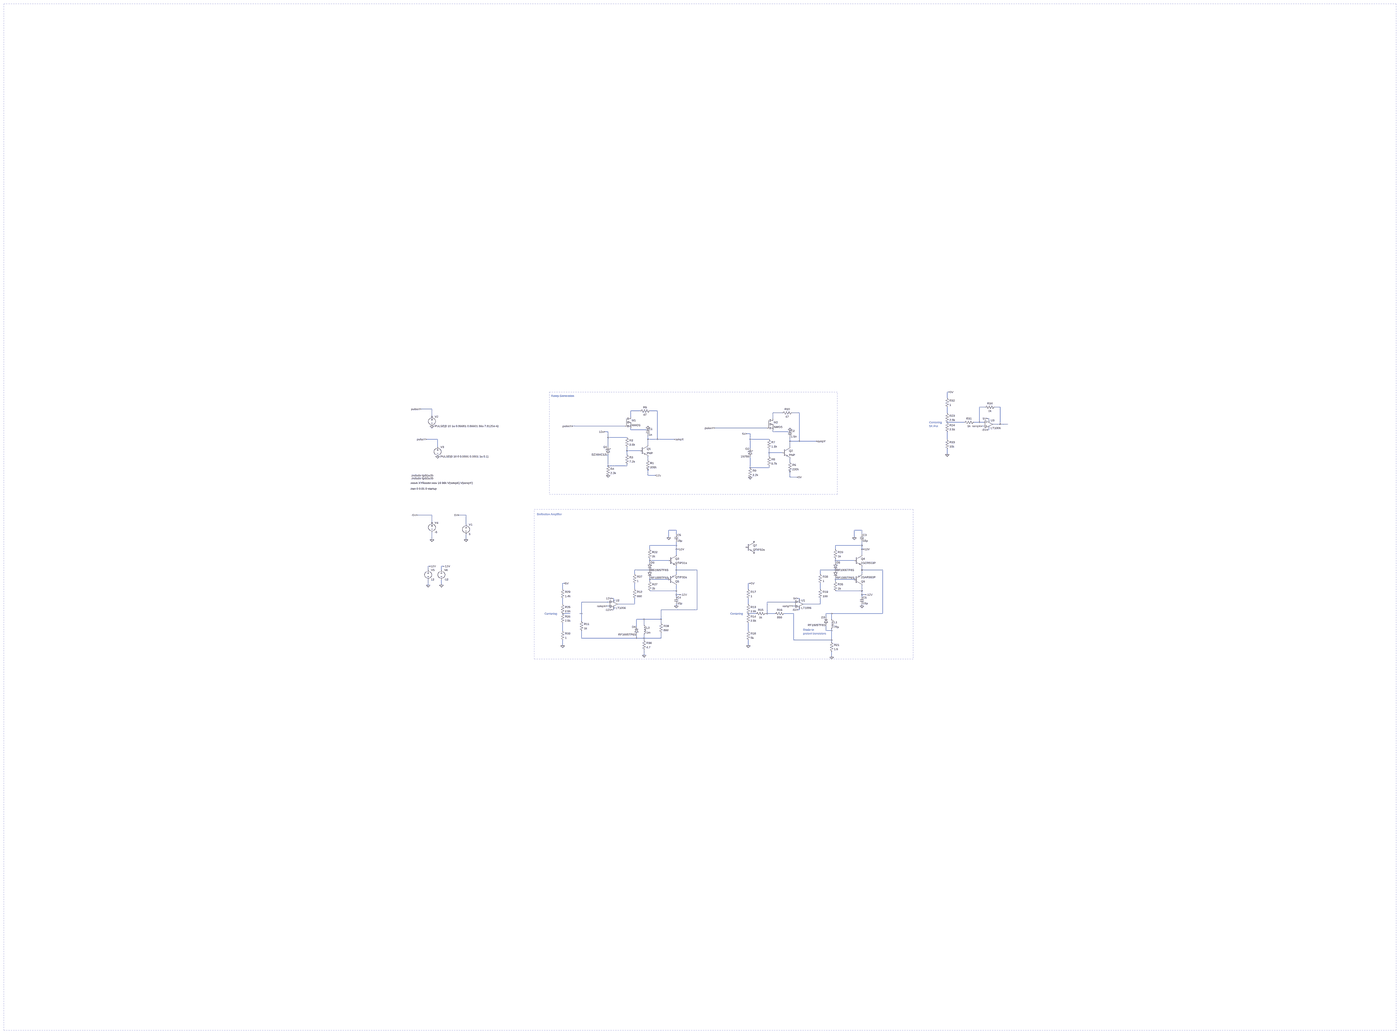
[diagram p0: schematic XYRasterScanGen.asc, whole sheet]
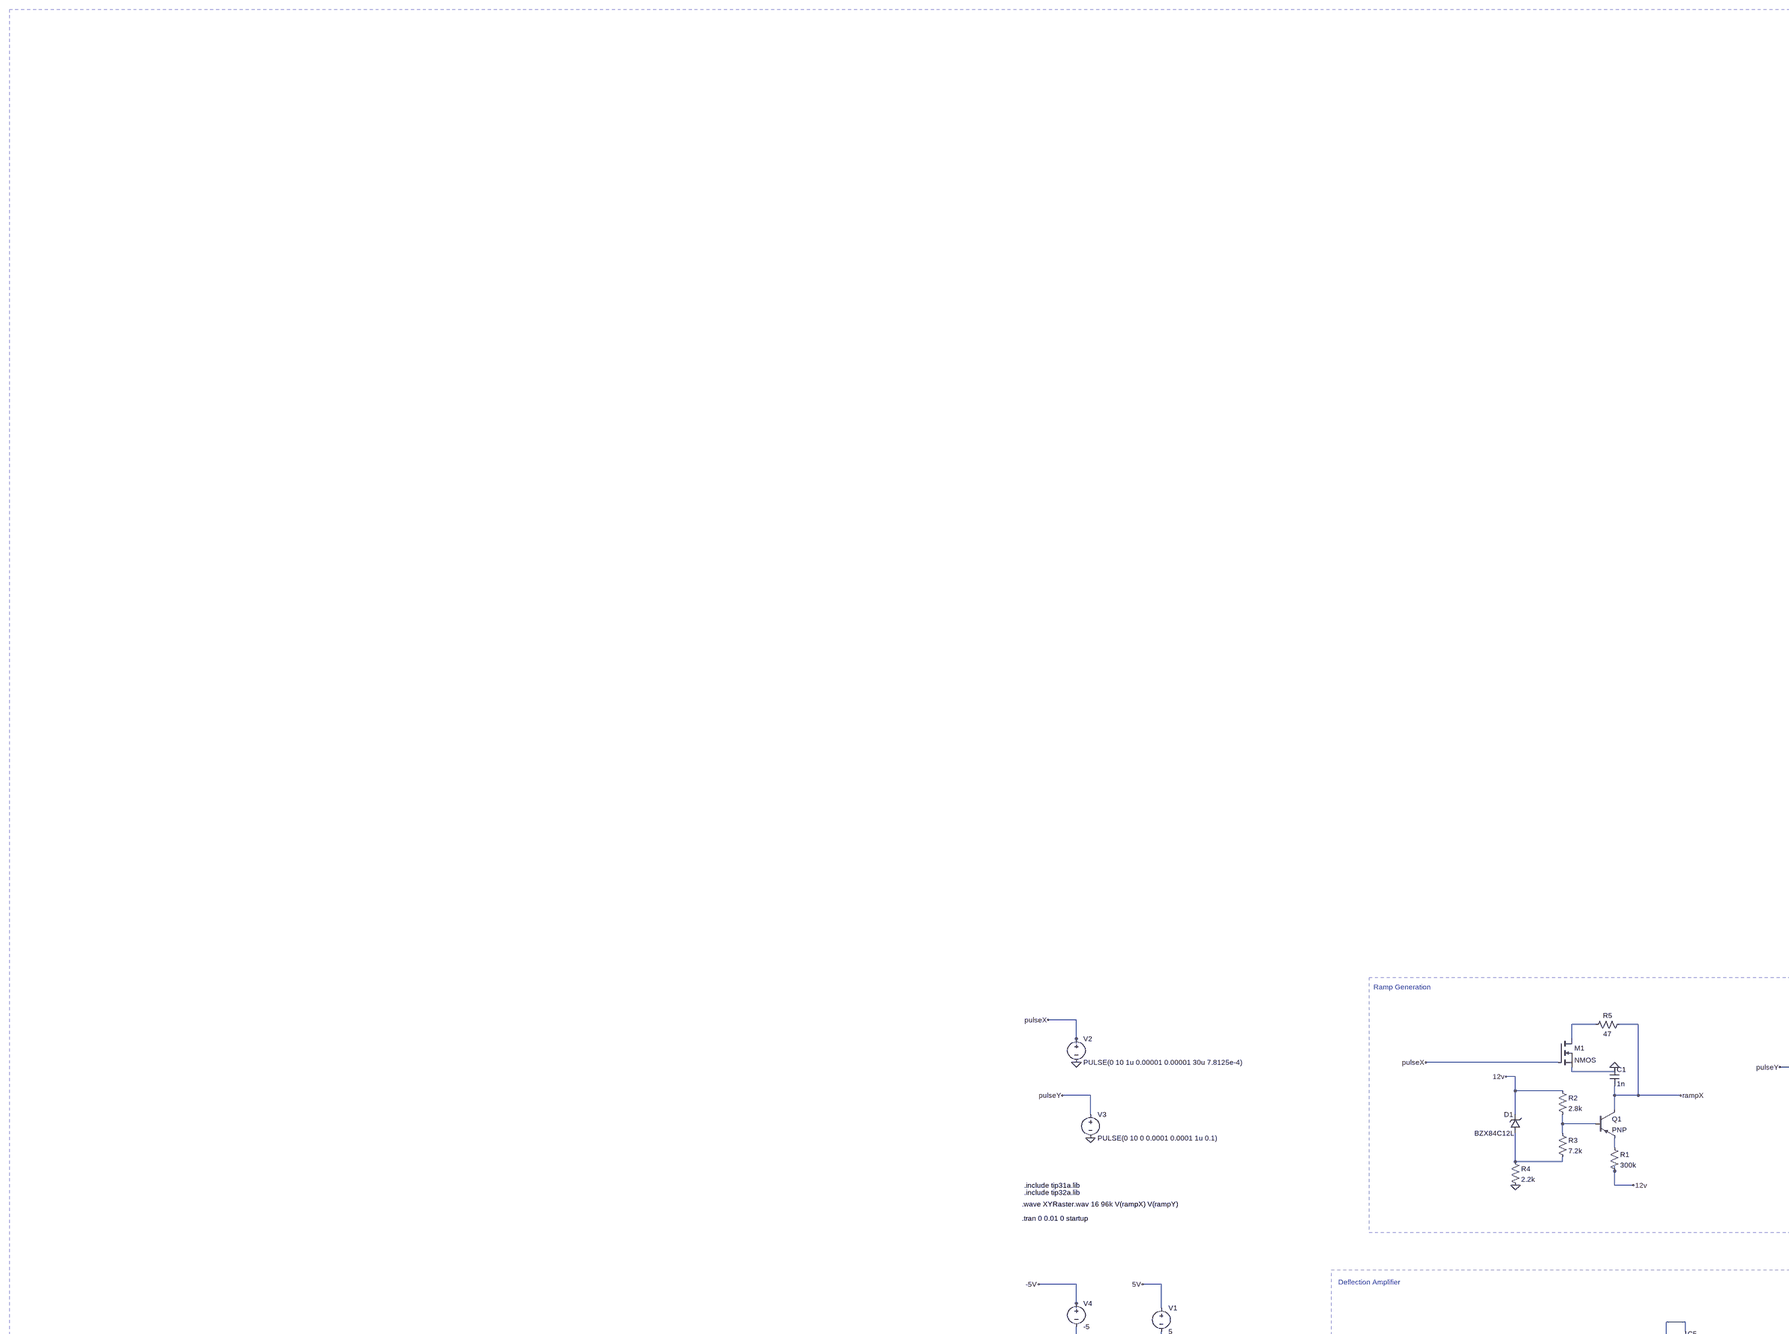
[diagram p1: schematic XYRasterScanGen.asc, part, row 1 of 2, column 1 of 2]
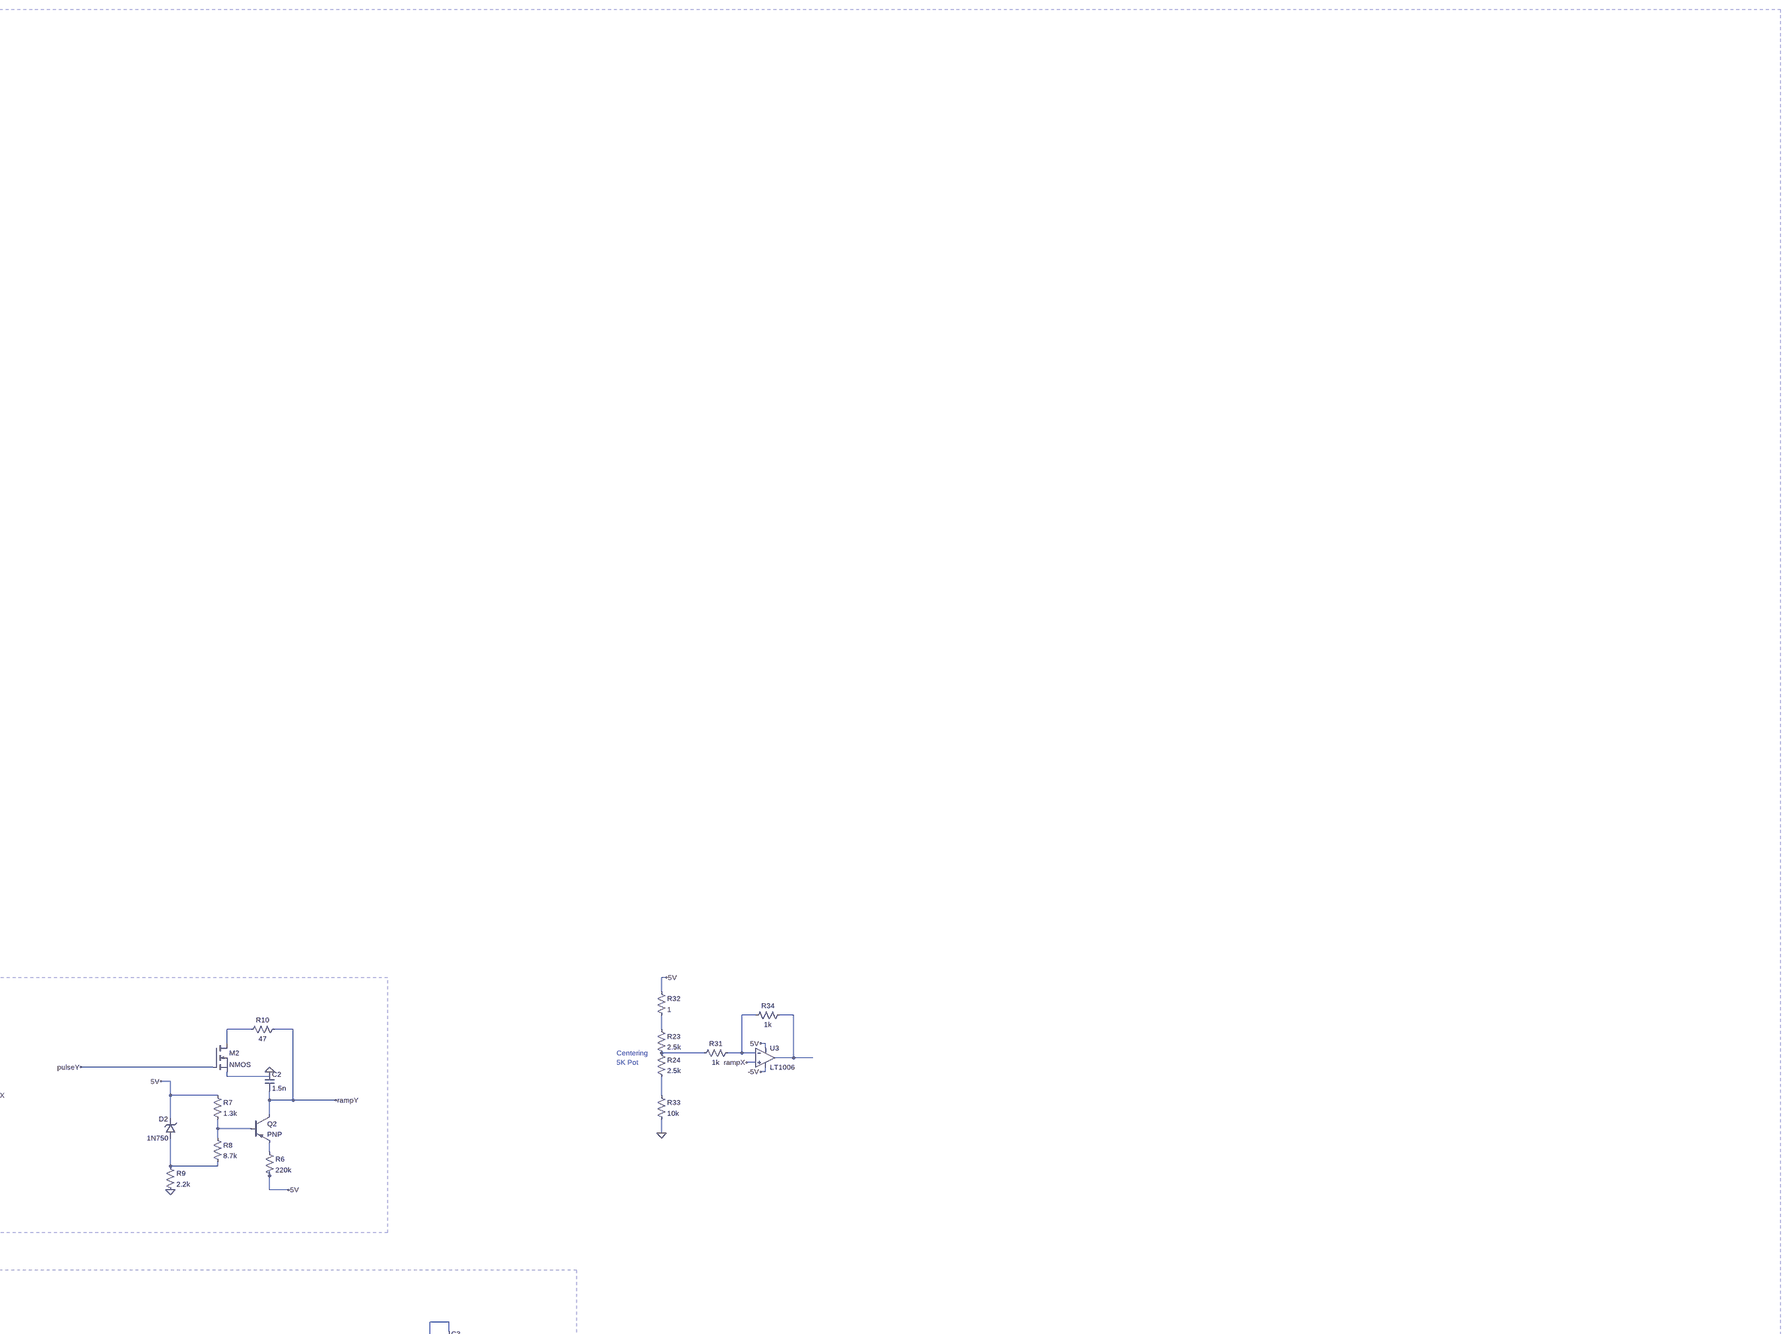
[diagram p2: schematic XYRasterScanGen.asc, part, row 1 of 2, column 2 of 2]
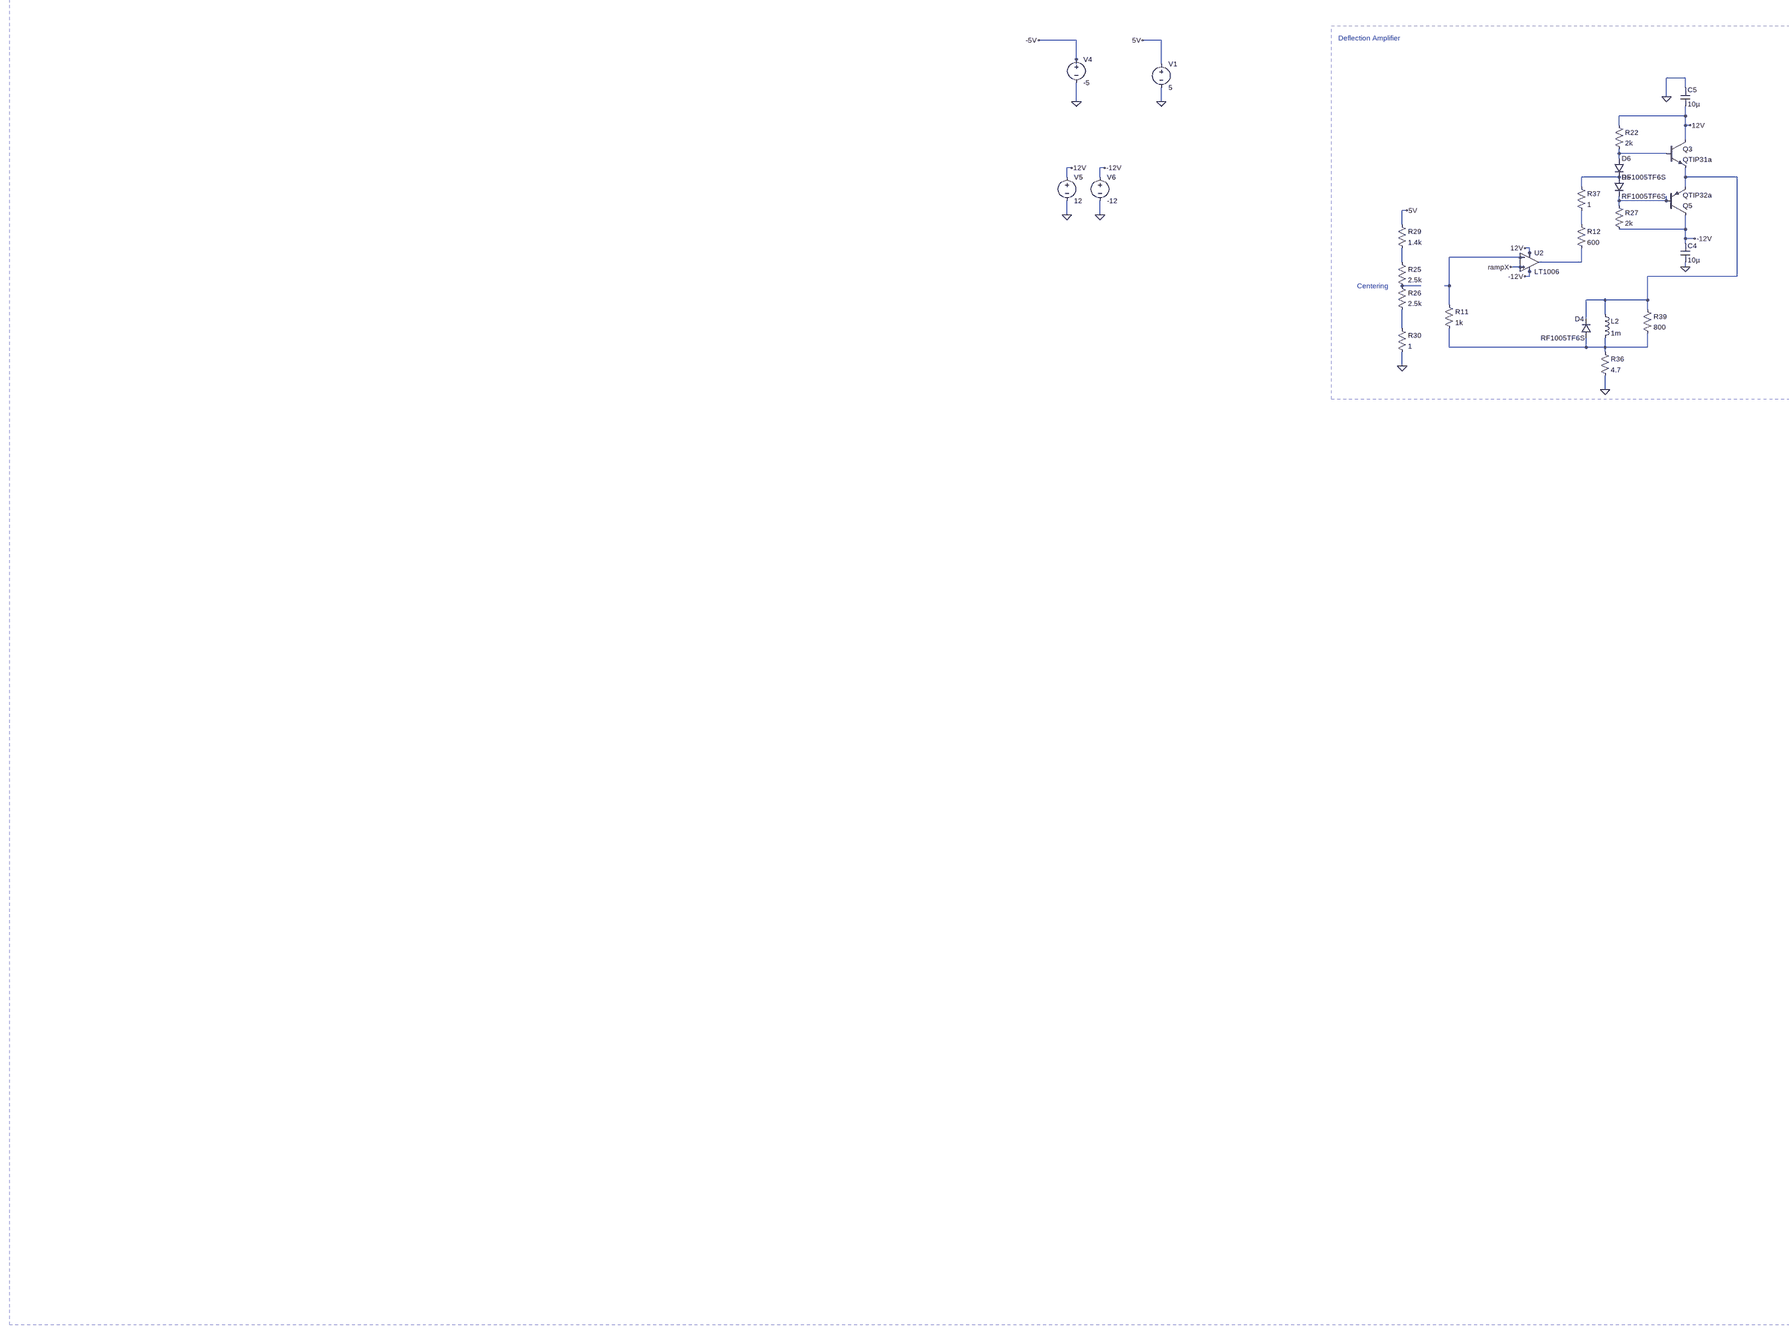
[diagram p3: schematic XYRasterScanGen.asc, part, row 2 of 2, column 1 of 2]
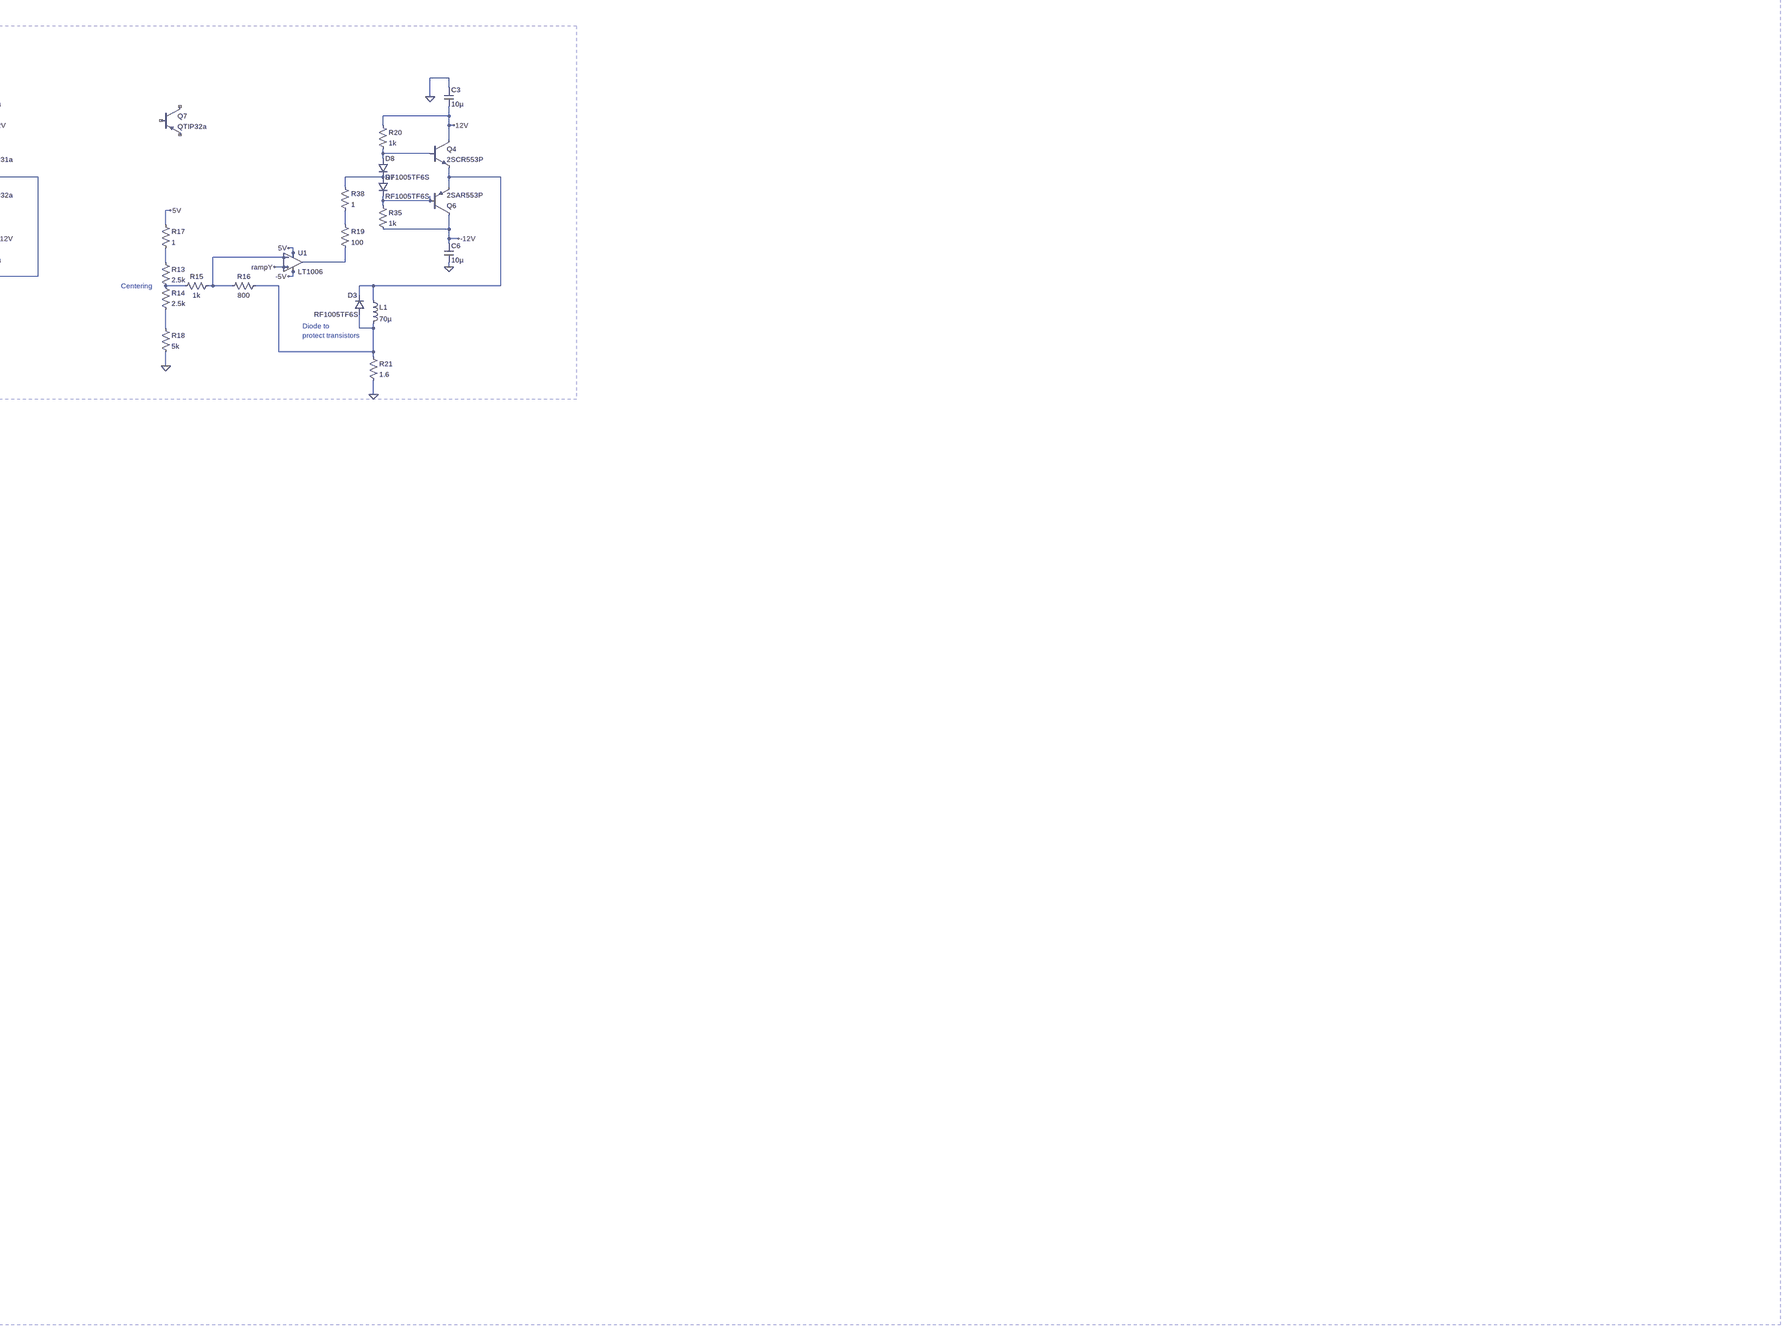
[diagram p4: schematic XYRasterScanGen.asc, part, row 2 of 2, column 2 of 2]
XYRasterScanGen.asc, the LTspice schematic file:
Version 4
SHEET 1 58724 33460
WIRE 1056 -464 1040 -464
WIRE 1040 -416 1040 -464
WIRE 1360 -336 1312 -336
WIRE 1488 -336 1440 -336
WIRE -3312 -320 -3408 -320
WIRE -1552 -304 -1632 -304
WIRE -1408 -304 -1472 -304
WIRE -352 -288 -432 -288
WIRE -208 -288 -272 -288
WIRE 1040 -288 1040 -336
WIRE -3312 -256 -3312 -320
WIRE -1632 -256 -1632 -304
WIRE -3312 -240 -3312 -256
WIRE -432 -240 -432 -288
WIRE 1392 -240 1376 -240
WIRE 1392 -224 1392 -240
WIRE 1184 -208 1040 -208
WIRE 1312 -208 1312 -336
WIRE 1312 -208 1264 -208
WIRE 1360 -208 1312 -208
WIRE 1488 -192 1488 -336
WIRE 1488 -192 1424 -192
WIRE 1552 -192 1488 -192
WIRE -1680 -176 -2128 -176
WIRE 1360 -176 1328 -176
WIRE -480 -160 -928 -160
WIRE -1632 -144 -1632 -160
WIRE -1488 -144 -1488 -160
WIRE -1488 -144 -1632 -144
WIRE 1392 -144 1392 -160
WIRE 1392 -144 1376 -144
WIRE -1824 -128 -1856 -128
WIRE -432 -128 -432 -144
WIRE -288 -128 -288 -144
WIRE -288 -128 -432 -128
WIRE -624 -112 -656 -112
WIRE -1824 -80 -1824 -128
WIRE -1664 -80 -1824 -80
WIRE -3264 -64 -3360 -64
WIRE -1488 -64 -1488 -96
WIRE -1408 -64 -1408 -304
WIRE -1408 -64 -1488 -64
WIRE -1264 -64 -1408 -64
WIRE -624 -64 -624 -112
WIRE -464 -64 -624 -64
WIRE 1040 -64 1040 -128
WIRE -288 -48 -288 -80
WIRE -208 -48 -208 -288
WIRE -208 -48 -288 -48
WIRE -64 -48 -208 -48
WIRE -1488 -16 -1488 -64
WIRE -3264 0 -3264 -64
WIRE -1824 0 -1824 -80
WIRE -288 0 -288 -48
WIRE -624 16 -624 -64
WIRE -1664 32 -1664 0
WIRE -1552 32 -1664 32
WIRE -464 48 -464 16
WIRE -352 48 -464 48
WIRE -1664 64 -1664 32
WIRE 1040 64 1040 16
WIRE -464 80 -464 48
WIRE -1488 112 -1488 80
WIRE -288 128 -288 96
WIRE -1824 160 -1824 64
WIRE -1664 160 -1664 144
WIRE -1664 160 -1824 160
WIRE -624 176 -624 80
WIRE -464 176 -464 160
WIRE -464 176 -624 176
WIRE -1488 192 -1488 176
WIRE -288 208 -288 192
WIRE -1488 240 -1488 192
WIRE -1424 240 -1488 240
WIRE -288 256 -288 208
WIRE -224 256 -288 256
WIRE -3312 576 -3440 576
WIRE -3024 576 -3088 576
WIRE -3312 640 -3312 576
WIRE -3312 656 -3312 640
WIRE -3024 656 -3024 576
WIRE -1248 704 -1312 704
WIRE 320 704 256 704
WIRE -1248 736 -1248 704
WIRE 320 736 320 704
WIRE -1312 768 -1312 704
WIRE 256 768 256 704
WIRE -3312 784 -3312 720
WIRE -3024 784 -3024 736
WIRE -1248 832 -1248 800
WIRE -1248 832 -1472 832
WIRE 320 832 320 800
WIRE 320 832 96 832
WIRE -1472 864 -1472 832
WIRE -1248 864 -1248 832
WIRE -1232 864 -1248 864
WIRE 96 864 96 832
WIRE 320 864 320 832
WIRE 336 864 320 864
WIRE -1248 912 -1248 864
WIRE 320 912 320 864
WIRE -1472 960 -1472 944
WIRE -1312 960 -1472 960
WIRE 96 960 96 944
WIRE 256 960 96 960
WIRE -1472 976 -1472 960
WIRE 96 976 96 960
WIRE -3328 1008 -3344 1008
WIRE -3216 1008 -3232 1008
WIRE -3344 1040 -3344 1008
WIRE -3232 1040 -3232 1008
WIRE -1472 1040 -1600 1040
WIRE -1248 1040 -1248 1008
WIRE -1072 1040 -1248 1040
WIRE 96 1040 -32 1040
WIRE 320 1040 320 1008
WIRE 496 1040 320 1040
WIRE -1600 1072 -1600 1040
WIRE -1248 1072 -1248 1040
WIRE -32 1072 -32 1040
WIRE 320 1072 320 1040
WIRE -1472 1120 -1472 1104
WIRE -1312 1120 -1312 1104
WIRE -1312 1120 -1472 1120
WIRE 96 1120 96 1104
WIRE 256 1120 256 1104
WIRE 256 1120 96 1120
WIRE -1472 1136 -1472 1120
WIRE 96 1136 96 1120
WIRE -2192 1152 -2208 1152
WIRE -624 1152 -640 1152
WIRE -3344 1168 -3344 1120
WIRE -3232 1168 -3232 1120
WIRE -2208 1200 -2208 1152
WIRE -1600 1200 -1600 1152
WIRE -640 1200 -640 1152
WIRE -32 1200 -32 1152
WIRE -1248 1216 -1248 1168
WIRE -1248 1216 -1472 1216
WIRE 320 1216 320 1168
WIRE 320 1216 96 1216
WIRE -1248 1248 -1248 1216
WIRE -1216 1248 -1248 1248
WIRE 320 1248 320 1216
WIRE 352 1248 320 1248
WIRE -1248 1264 -1248 1248
WIRE 320 1264 320 1248
WIRE -1776 1280 -1792 1280
WIRE -208 1280 -224 1280
WIRE -1776 1296 -1776 1280
WIRE -208 1296 -208 1280
WIRE -1808 1312 -2048 1312
WIRE -1792 1312 -1808 1312
WIRE -1776 1312 -1776 1296
WIRE -240 1312 -480 1312
WIRE -224 1312 -240 1312
WIRE -208 1312 -208 1296
WIRE -2208 1328 -2208 1280
WIRE -1600 1328 -1600 1280
WIRE -1600 1328 -1744 1328
WIRE -640 1328 -640 1280
WIRE -32 1328 -32 1280
WIRE -32 1328 -176 1328
WIRE -1808 1344 -1840 1344
WIRE -1792 1344 -1808 1344
WIRE -1248 1344 -1248 1328
WIRE -240 1344 -272 1344
WIRE -224 1344 -240 1344
WIRE 320 1344 320 1328
WIRE -1776 1360 -1776 1344
WIRE -208 1360 -208 1344
WIRE -1776 1376 -1776 1360
WIRE -1776 1376 -1792 1376
WIRE -1072 1376 -1072 1040
WIRE -1072 1376 -1376 1376
WIRE -208 1376 -208 1360
WIRE -208 1376 -224 1376
WIRE -2144 1408 -2208 1408
WIRE -2048 1408 -2048 1312
WIRE -2048 1408 -2064 1408
WIRE -576 1408 -640 1408
WIRE -480 1408 -480 1312
WIRE -480 1408 -496 1408
WIRE -416 1408 -480 1408
WIRE -256 1408 -336 1408
WIRE 64 1408 16 1408
WIRE 496 1408 496 1040
WIRE 496 1408 64 1408
WIRE 16 1440 16 1408
WIRE -1520 1456 -1584 1456
WIRE -1376 1456 -1376 1376
WIRE -1376 1456 -1520 1456
WIRE 64 1456 64 1408
WIRE -2048 1472 -2048 1408
WIRE -1376 1488 -1376 1456
WIRE -1520 1504 -1520 1456
WIRE -1584 1520 -1584 1456
WIRE -2208 1552 -2208 1488
WIRE -640 1552 -640 1488
WIRE 16 1552 16 1504
WIRE 64 1552 64 1536
WIRE 64 1552 16 1552
WIRE -2048 1616 -2048 1552
WIRE -1584 1616 -1584 1584
WIRE -1584 1616 -2048 1616
WIRE -1520 1616 -1520 1584
WIRE -1520 1616 -1584 1616
WIRE -1376 1616 -1376 1568
WIRE -1376 1616 -1520 1616
WIRE -1520 1632 -1520 1616
WIRE -256 1632 -256 1408
WIRE 64 1632 64 1552
WIRE 64 1632 -256 1632
WIRE 64 1648 64 1632
WIRE -2208 1680 -2208 1632
WIRE -640 1680 -640 1632
WIRE -1520 1760 -1520 1712
WIRE 64 1776 64 1728
FLAG -3024 784 0
FLAG -3088 576 5V
FLAG -1424 240 12v
FLAG -1824 240 0
FLAG -1856 -128 12v
FLAG -1488 -160 0
FLAG -1264 -64 rampX
FLAG -224 256 5V
FLAG -624 256 0
FLAG -656 -112 5V
FLAG -288 -144 0
FLAG -64 -48 rampY
FLAG -3408 -320 pulseX
FLAG -3360 -64 pulseY
FLAG -3312 -176 0
FLAG -3264 80 0
FLAG -2128 -176 pulseX
FLAG -928 -160 pulseY
FLAG -3312 784 0
FLAG -3440 576 -5V
FLAG -3328 1008 12V
FLAG -3216 1008 -12V
FLAG -3344 1168 0
FLAG -3232 1168 0
FLAG -1232 864 12V
FLAG -1840 1344 rampX
FLAG -1792 1280 12V
FLAG -1792 1376 -12V
FLAG -2192 1152 5V
FLAG -1312 768 0
FLAG -1216 1248 -12V
FLAG -1248 1344 0
FLAG -2208 1680 0
FLAG -1520 1760 0
FLAG -272 1344 rampY
FLAG -224 1280 5V
FLAG -224 1376 -5V
FLAG -624 1152 5V
FLAG -640 1680 0
FLAG 64 1776 0
FLAG 1056 -464 5V
FLAG 1040 64 0
FLAG 1328 -176 rampX
FLAG 1376 -240 5V
FLAG 1376 -144 -5V
FLAG 336 864 12V
FLAG 256 768 0
FLAG 352 1248 -12V
FLAG 320 1344 0
SYMBOL voltage -3024 640 R0
WINDOW 123 0 0 Left 2
WINDOW 39 0 0 Left 2
SYMATTR InstName V1
SYMATTR Value 5
SYMBOL pnp -1552 -16 R0
SYMATTR InstName Q1
SYMBOL res -1504 96 R0
SYMATTR InstName R1
SYMATTR Value 300k
SYMBOL res -1680 -96 R0
SYMATTR InstName R2
SYMATTR Value 2.8k
SYMBOL res -1680 48 R0
SYMATTR InstName R3
SYMATTR Value 7.2k
SYMBOL zener -1808 64 R180
WINDOW 0 24 64 Left 2
WINDOW 3 24 0 Left 2
SYMATTR InstName D1
SYMATTR Value BZX84C12L
SYMBOL res -1840 144 R0
SYMATTR InstName R4
SYMATTR Value 2.2k
SYMBOL cap -1504 -160 R0
SYMATTR InstName C1
SYMATTR Value 1n
SYMBOL nmos -1680 -256 R0
SYMATTR InstName M1
SYMBOL res -1456 -320 R90
WINDOW 0 0 56 VBottom 2
WINDOW 3 32 56 VTop 2
SYMATTR InstName R5
SYMATTR Value 47
SYMBOL pnp -352 0 R0
SYMATTR InstName Q2
SYMBOL res -304 112 R0
SYMATTR InstName R6
SYMATTR Value 220k
SYMBOL res -480 -80 R0
SYMATTR InstName R7
SYMATTR Value 1.3k
SYMBOL res -480 64 R0
SYMATTR InstName R8
SYMATTR Value 8.7k
SYMBOL zener -608 80 R180
WINDOW 0 24 64 Left 2
WINDOW 3 24 0 Left 2
SYMATTR InstName D2
SYMATTR Value 1N750
SYMBOL res -640 160 R0
SYMATTR InstName R9
SYMATTR Value 2.2k
SYMBOL cap -304 -144 R0
SYMATTR InstName C2
SYMATTR Value 1.5n
SYMBOL nmos -480 -240 R0
SYMATTR InstName M2
SYMBOL res -256 -304 R90
WINDOW 0 0 56 VBottom 2
WINDOW 3 32 56 VTop 2
SYMATTR InstName R10
SYMATTR Value 47
SYMBOL voltage -3312 -272 R0
WINDOW 123 0 0 Left 2
WINDOW 39 0 0 Left 2
SYMATTR InstName V2
SYMATTR Value PULSE(0 10 1u 0.00001 0.00001 30u 7.8125e-4)
SYMBOL voltage -3264 -16 R0
WINDOW 123 0 0 Left 2
WINDOW 39 0 0 Left 2
SYMATTR InstName V3
SYMATTR Value PULSE(0 10 0 0.0001 0.0001 1u 0.1)
SYMBOL voltage -3312 624 R0
WINDOW 123 0 0 Left 2
WINDOW 39 0 0 Left 2
SYMATTR InstName V4
SYMATTR Value -5
SYMBOL voltage -3344 1024 R0
WINDOW 123 0 0 Left 2
WINDOW 39 0 0 Left 2
SYMATTR InstName V5
SYMATTR Value 12
SYMBOL voltage -3232 1024 R0
WINDOW 123 0 0 Left 2
WINDOW 39 0 0 Left 2
SYMATTR InstName V6
SYMATTR Value -12
SYMBOL npn -1312 912 R0
SYMATTR InstName Q3
SYMATTR Value QTIP31a
SYMBOL ind -1536 1488 R0
SYMATTR InstName L2
SYMATTR Value 1m
SYMATTR SpiceLine Rser=1
SYMBOL res -2224 1312 R0
SYMATTR InstName R25
SYMATTR Value 2.5k
SYMBOL res -2224 1392 R0
SYMATTR InstName R26
SYMATTR Value 2.5k
SYMBOL res -2224 1184 R0
SYMATTR InstName R29
SYMATTR Value 1.4k
SYMBOL pnp -1312 1168 M180
SYMATTR InstName Q5
SYMATTR Value QTIP32a
SYMBOL cap -1264 736 R0
SYMATTR InstName C5
SYMATTR Value 10µ
SYMBOL res -2224 1536 R0
SYMATTR InstName R30
SYMATTR Value 1
SYMBOL res -1616 1184 R0
SYMATTR InstName R12
SYMATTR Value 600
SYMBOL cap -1264 1264 R0
SYMATTR InstName C4
SYMATTR Value 10µ
SYMBOL Opamps\\LT1006 -1776 1264 R0
SYMATTR InstName U2
SYMBOL ind 48 1440 R0
SYMATTR InstName L1
SYMATTR Value 70µ
SYMATTR SpiceLine Rser=1
SYMBOL res -656 1312 R0
SYMATTR InstName R13
SYMATTR Value 2.5k
SYMBOL res -656 1392 R0
SYMATTR InstName R14
SYMATTR Value 2.5k
SYMBOL res -480 1392 R90
WINDOW 0 0 56 VBottom 2
WINDOW 3 32 56 VTop 2
SYMATTR InstName R15
SYMATTR Value 1k
SYMBOL res -320 1392 R90
WINDOW 0 0 56 VBottom 2
WINDOW 3 32 56 VTop 2
SYMATTR InstName R16
SYMATTR Value 800
SYMBOL res -656 1184 R0
SYMATTR InstName R17
SYMATTR Value 1
SYMBOL diode 32 1504 R180
WINDOW 0 24 64 Left 2
WINDOW 3 24 0 Left 2
SYMATTR InstName D3
SYMATTR Value RF1005TF6S
SYMBOL res -656 1536 R0
SYMATTR InstName R18
SYMATTR Value 5k
SYMBOL Opamps\\LT1006 -208 1264 R0
SYMATTR InstName U1
SYMBOL res 48 1632 R0
SYMATTR InstName R21
SYMATTR Value 1.6
SYMBOL Opamps\\LT1006 1392 -256 R0
SYMATTR InstName U3
SYMBOL res 1024 -304 R0
SYMATTR InstName R23
SYMATTR Value 2.5k
SYMBOL res 1024 -224 R0
SYMATTR InstName R24
SYMATTR Value 2.5k
SYMBOL res 1280 -224 R90
WINDOW 0 0 56 VBottom 2
WINDOW 3 32 56 VTop 2
SYMATTR InstName R31
SYMATTR Value 1k
SYMBOL res 1024 -432 R0
SYMATTR InstName R32
SYMATTR Value 1
SYMBOL res 1456 -352 R90
WINDOW 0 0 56 VBottom 2
WINDOW 3 32 56 VTop 2
SYMATTR InstName R34
SYMATTR Value 1k
SYMBOL res 1024 -80 R0
SYMATTR InstName R33
SYMATTR Value 10k
SYMBOL diode -1568 1584 R180
WINDOW 0 24 64 Left 2
WINDOW 3 24 0 Left 2
SYMATTR InstName D4
SYMATTR Value RF1005TF6S
SYMBOL diode -1488 1040 R0
SYMATTR InstName D5
SYMATTR Value RF1005TF6S
SYMBOL diode -1488 976 R0
SYMATTR InstName D6
SYMATTR Value RF1005TF6S
SYMBOL res -1488 848 R0
SYMATTR InstName R22
SYMATTR Value 2k
SYMBOL res -1488 1120 R0
SYMATTR InstName R27
SYMATTR Value 2k
SYMBOL res -1536 1616 R0
SYMATTR InstName R36
SYMATTR Value 4.7
SYMBOL res -2064 1456 R0
SYMATTR InstName R11
SYMATTR Value 1k
SYMBOL npn 256 912 R0
SYMATTR InstName Q4
SYMATTR Value 2SCR553P
SYMBOL pnp 256 1168 M180
SYMATTR InstName Q6
SYMATTR Value 2SAR553P
SYMBOL cap 304 736 R0
SYMATTR InstName C3
SYMATTR Value 10µ
SYMBOL res -48 1184 R0
SYMATTR InstName R19
SYMATTR Value 100
SYMBOL cap 304 1264 R0
SYMATTR InstName C6
SYMATTR Value 10µ
SYMBOL diode 80 1040 R0
SYMATTR InstName D7
SYMATTR Value RF1005TF6S
SYMBOL diode 80 976 R0
SYMATTR InstName D8
SYMATTR Value RF1005TF6S
SYMBOL res 80 848 R0
SYMATTR InstName R20
SYMATTR Value 1k
SYMBOL res 80 1120 R0
SYMATTR InstName R35
SYMATTR Value 1k
SYMBOL res -1616 1056 R0
SYMATTR InstName R37
SYMATTR Value 1
SYMBOL res -48 1056 R0
SYMATTR InstName R38
SYMATTR Value 1
SYMBOL pnp -656 800 R0
SYMATTR InstName Q7
SYMATTR Value QTIP32a
SYMBOL res -1392 1472 R0
SYMATTR InstName R39
SYMATTR Value 800
TEXT -3496 352 Left 2 !.tran 0 0.01 0 startup
TEXT -3496 304 Left 2 !.wave XYRaster.wav 16 96k V(rampX) V(rampY)
TEXT -2304 -432 Left 2 ;Ramp Generation
TEXT -2360 1408 Left 2 ;Centering
TEXT -2424 568 Left 2 ;Deflection Amplifier
TEXT -176 1544 Left 2 ;Diode to \nprotect transistors
TEXT -792 1408 Left 2 ;Centering
TEXT 888 -208 Left 2 ;Centering\n5K Pot
TEXT -3488 264 Left 2 !.include tip32a.lib
TEXT -3488 240 Left 2 !.include tip31a.lib
RECTANGLE Normal 112 -464 -2320 400 2
RECTANGLE Normal 752 1792 -2448 528 2
RECTANGLE Normal 4832 4928 -6928 -3744 2

The netlist it stands for:
* XYRasterScanGen.asc
V1 5V 0 5
Q1 rampX N008 N010 0 PNP
R1 N010 12v 300k
R2 12v N008 2.8k
R3 N008 N012 7.2k
D1 N012 12v BZX84C12L
R4 N012 0 2.2k
C1 0 rampX 1n
M1 N003 pulseX 0 0 NMOS
R5 rampX N003 47
Q2 rampY N009 N011 0 PNP
R6 N011 5V 220k
R7 5V N009 1.3k
R8 N009 N013 8.7k
D2 N013 5V 1N750
R9 N013 0 2.2k
C2 0 rampY 1.5n
M2 N004 pulseY 0 0 NMOS
R10 rampY N004 47
V2 pulseX 0 PULSE(0 10 1u 0.00001 0.00001 30u 7.8125e-4)
V3 pulseY 0 PULSE(0 10 0 0.0001 0.0001 1u 0.1)
V4 -5V 0 -5
V5 12v 0 12
V6 -12V 0 -12
Q3 12v N014 N017 0 QTIP31a
L2 N017 N035 1m Rser=1
R25 N026 N030 2.5k
R26 N030 N033 2.5k
R29 5V N026 1.4k
Q5 -12V N020 N017 0 QTIP32a
C5 0 12v 10µ
R30 N033 0 1
R12 N022 N027 600
C4 -12V 0 10µ
XU2 rampX N024 12v -12V N027 LT1006  ; pins In+ In- V+ V- OUT
L1 N019 N032 70µ Rser=1
R13 N028 N031 2.5k
R14 N031 N034 2.5k
R15 N025 N031 1k
R16 N032 N025 800
R17 5V N028 1
D3 N032 N019 RF1005TF6S
R18 N034 0 5k
XU1 rampY N025 5V -5V N029 LT1006  ; pins In+ In- V+ V- OUT
R21 N032 0 1.6
XU3 rampX N001 5V -5V N002 LT1006  ; pins In+ In- V+ V- OUT
R23 N005 N006 2.5k
R24 N006 N007 2.5k
R31 N001 N006 1k
R32 5V N005 1
R34 N002 N001 1k
R33 N007 0 10k
D4 N035 N017 RF1005TF6S
D5 N016 N020 RF1005TF6S
D6 N014 N016 RF1005TF6S
R22 12v N014 2k
R27 N020 -12V 2k
R36 N035 0 4.7
R11 N024 N035 1k
Q4 12v N015 N019 0 2SCR553P
Q6 -12V N021 N019 0 2SAR553P
C3 0 12v 10µ
R19 N023 N029 100
C6 -12V 0 10µ
D7 N018 N021 RF1005TF6S
D8 N015 N018 RF1005TF6S
R20 12v N015 1k
R35 N021 -12V 1k
R37 N016 N022 1
R38 N018 N023 1
Q7 NC_01 NC_02 NC_03 0 QTIP32a
R39 N017 N035 800
.model D D
.lib standard.dio
.model NPN NPN
.model PNP PNP
.lib standard.bjt
.model NMOS NMOS
.model PMOS PMOS
.lib standard.mos
.tran 0 0.01 0 startup
.wave XYRaster.wav 16 96k V(rampX) V(rampY)
* Ramp Generation
* Centering
* Deflection Amplifier
* Diode to
* protect transistors
* Centering
* Centering
* 5K Pot
.include tip32a.lib
.include tip31a.lib
.lib LTC.lib
.backanno
.end